# Altium project learning_altium.PrjPcb
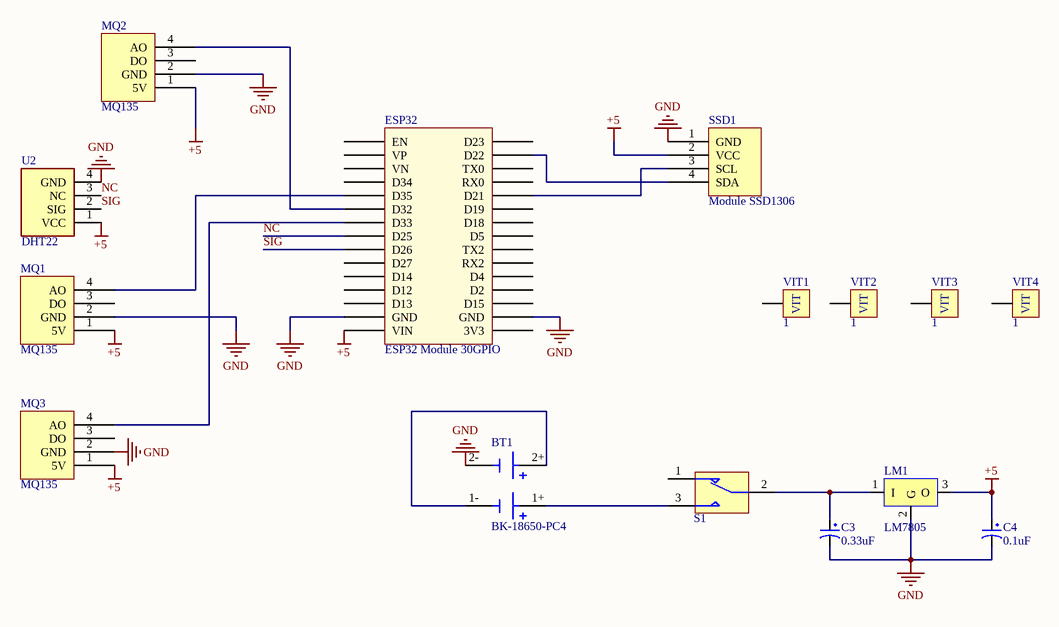
[diagram p0: Sheet1.SchDoc]
1 sheet, 15 parts. Net scope: global (net labels, ports and power ports of the same name join across sheets).
Board file: PCB1.PcbDoc

## Sheet Sheet1.SchDoc
size A; SheetNumber: 1; SheetTotal: 1

### Parts
BT1  BK-18650-PC4  [BAT_BK-18650-PC4]
C3  0.33uF  [tu hoa 5mm]
C4  0.1uF  [tu hoa 5mm]
ESP32  ESP32 Module 30GPIO  [ESP32 Module 30GPIO_v2]
LM1  LM7805  [TO220NH]
MQ1  MQ135  [MQ135]
MQ2  MQ135  [MQ135]
MQ3  MQ135  [MQ135]
S1  Switch SPDT_Subminiator  [SPDT Subminiator]  (value not drawn)
SSD1  Module SSD1306  [Module SSD1306]
U2  DHT22  [DHT22_180]
VIT1  1  [Screw octagon 3.81mm]
VIT2  1  [Screw octagon 3.81mm]
VIT3  1  [Screw octagon 3.81mm]
VIT4  1  [Screw octagon 3.81mm]

### Nets
+5: C4.1 ESP32.30(VIN) LM1.3(O) MQ1.1(5V) MQ2.1(5V) MQ3.1(5V) SSD1.2(VCC) U2.1(VCC)
GND: BT1.2- C3.2 C4.2 ESP32.14(GND) ESP32.29(GND) LM1.2(G) MQ1.2(GND) MQ2.2(GND) MQ3.2(GND) SSD1.1(GND) U2.4(GND)
NC: ESP32.23(D25) U2.3(NC)
SIG: ESP32.24(D26) U2.2(SIG)
NetBT1_1+: BT1.1+ S1.3
NetBT1_1-: BT1.1- BT1.2+
NetC3_1: C3.1 LM1.1(I) S1.2
NetESP32_2: ESP32.2(D22) SSD1.4(SDA)
NetESP32_5: ESP32.5(D21) SSD1.3(SCL)
NetESP32_20: ESP32.20(D35) MQ1.4(AO)
NetESP32_21: ESP32.21(D32) MQ2.4(AO)
NetESP32_22: ESP32.22(D33) MQ3.4(AO)

Not connected (* = marked no-connect by the designer): ESP32 1(D23) 3(TX0) 4(RX0) 6(D19) 7(D18) 8(D5) 9(TX2) 10(RX2) 11(D4) 12(D2) 13(D15) 15(3V3) 16(EN) 17(VP) 18(VN) 19(D34) 25(D27) 26(D14) 27(D12) 28(D13); MQ1 3(DO); MQ2 3(DO); MQ3 3(DO); S1 1; VIT1 1; VIT2 1; VIT3 1; VIT4 1

### Library data of the parts
BT1 = BK-18650-PC4: Battery Holder (Open) 18650 2 Cell PC Pin; Price: None; Value: *; Package: None; Availability: Unavailable; MP: BK-18650-PC4
C3 = Tu Hoa 0.33uF 50V 5x11: Cắm; Don_Vi: Con; So_Chan: 2; Ten_Linh_Kien: Tụ Hóa 0.33uF 50V 5x11MM; Ma_Hang: MH004655; Chung_Loai: Cắm; Kieu_Chan: *
C4 = Tu Hoa 0.1uF 50V 5x11: Cắm; Don_Vi: Con; So_Chan: 2; Ten_Linh_Kien: Tụ Hóa 0.1uF 50V; Ma_Hang: MH006853; Chung_Loai: Cắm; Kieu_Chan: *
LM1 = LM78xx: IC REG LDO 5V 1A TO220-3
S1 = Switch SPDT_Subminiator: Subminiator SPDT Switch; Company: E.P.I.L; Design date: 2011/11/02
U2 = DHT22: SENSOR HUMIDITY/TEMPERATURE; Digikey PN: 1528-1228-ND
VIT1-VIT4 = VIT: Vit xuyen lo; Chung_Loai: Cắm; Ma_Hang: MH002051; Ten_Linh_Kien: CON 2 KF142R 5.08MM; Don_Vi: Con; Ghi_Chu: *; Kieu_Chan: *